# EAGLE schematic 128rfr2 (EAGLE 6.4)
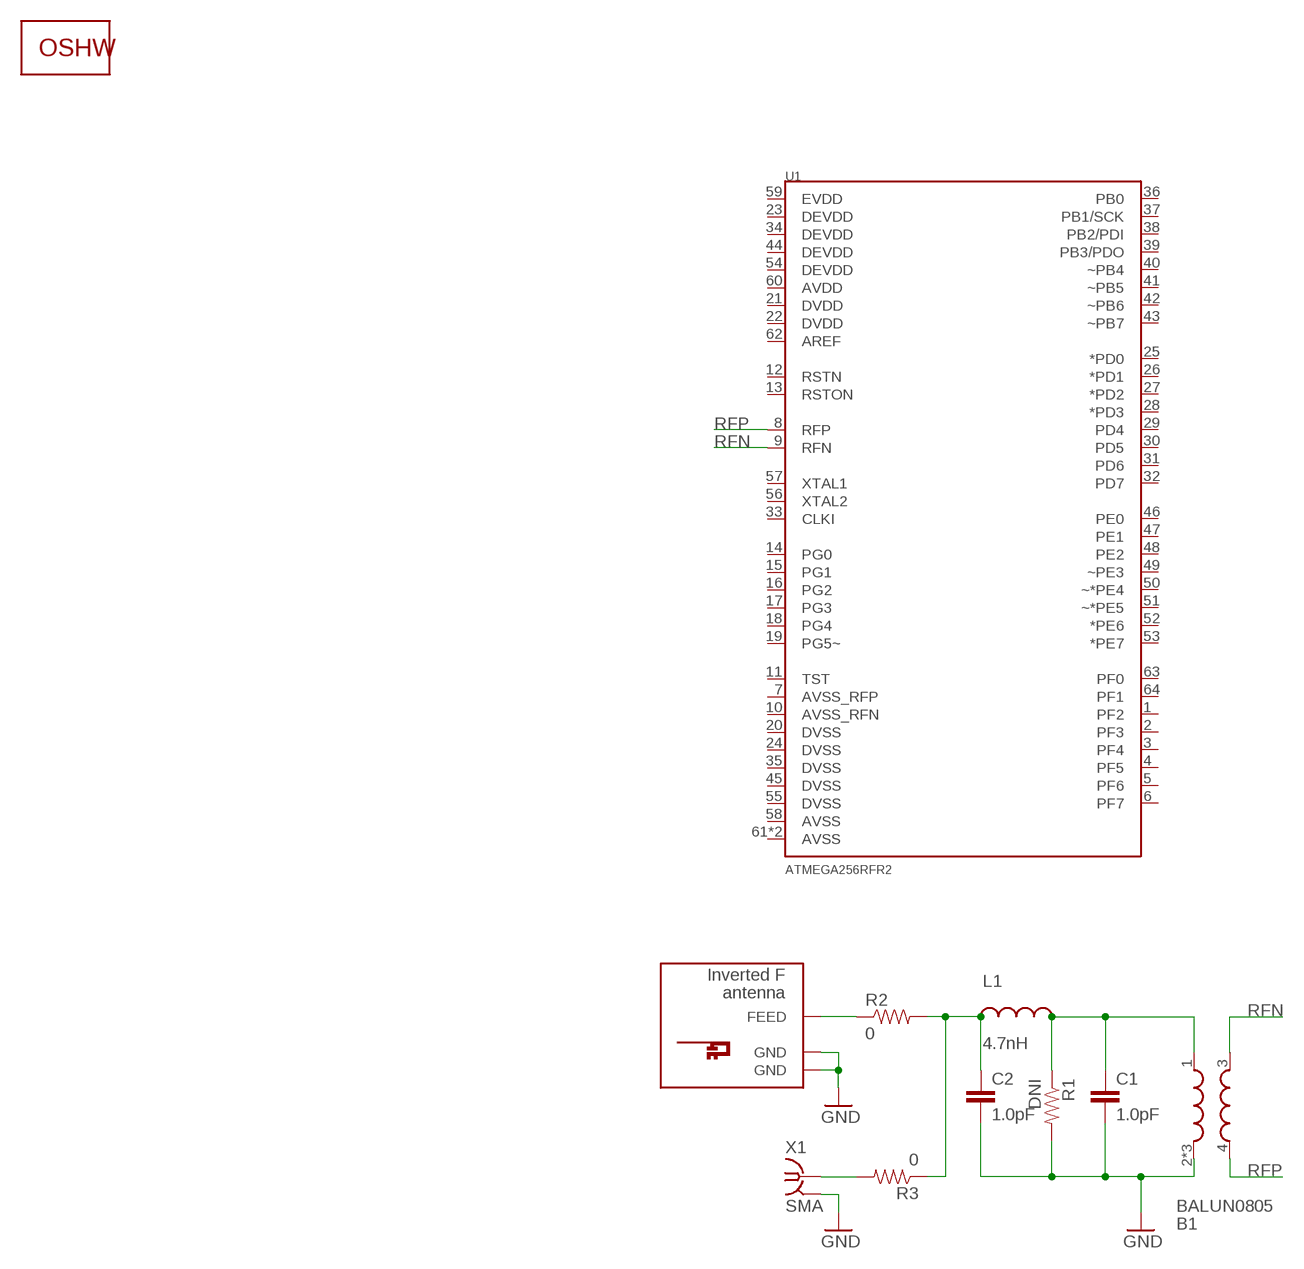
[diagram p0: schematic, sheet 1]

## Parts
B1  BALUN0805  [BALUN-2-4GHZ]
C1  1.0pF  CAP0402-CAP  [0402-CAP]
C2  1.0pF  CAP0402-CAP  [0402-CAP]
L1  4.7nH  INDUCTOR  [0402-CAP]
R1  DNI  RESISTOR0402-RES  [0402-RES]
R2  0  RESISTOR0402-RES  [0402-RES]
R3  0  RESISTOR0402-RES  [0402-RES]
U1  ATMEGA256RFR2  [QFN-64]
U$1  INVERTED_F_ANTENNA+5  [DN007+5]
U$2  LOGO-OSHWCOPPER  [LOGO-OSHW-COPPER]
X1  SMA  SMA-142-0701-801/806  [J502-ND-142-0701-801/806]

## Nets
GND: B1.2(GND) B1.5(GND) B1.6(GND) C1.2 C2.2 R1.2 U$1.GND U$1.GND@1(GND) X1.G@1 X1.G@2 X1.G@3 X1.G@4
N$1: R2.1 U$1.FEED
N$2: B1.1(IN) C1.1 L1.2 R1.1
N$3: C2.1 L1.1 R2.2 R3.1
N$4: R3.2 X1.1
RFN: B1.3(OUT1) U1.9(RFN)
RFP: B1.4(OUT2) U1.8(RFP)
Unconnected: U1.1(PF2) U1.2(PF3) U1.3(PF4) U1.4(PF5) U1.5(PF6) U1.6(PF7) U1.7(AVSS_RFP) U1.10(AVSS_RFN) U1.11(TST) U1.12(RSTN) U1.13(RSTON) U1.14(PG0) U1.15(PG1) U1.16(PG2) U1.17(PG3) U1.18(PG4) U1.19(PG5~) U1.20(DVSS) U1.21(DVDD) U1.22(DVDD) U1.23(DEVDD) U1.24(DVSS) U1.25(*PD0) U1.26(*PD1) U1.27(*PD2) U1.28(*PD3) U1.29(PD4) U1.30(PD5) U1.31(PD6) U1.32(PD7) U1.33(CLKI) U1.34(DEVDD) U1.35(DVSS) U1.36(PB0) U1.37(PB1/SCK) U1.38(PB2/PDI) U1.39(PB3/PDO) U1.40(~PB4) U1.41(~PB5) U1.42(~PB6) U1.43(~PB7) U1.44(DEVDD) U1.45(DVSS) U1.46(PE0) U1.47(PE1) U1.48(PE2) U1.49(~PE3) U1.50(~*PE4) U1.51(~*PE5) U1.52(*PE6) U1.53(*PE7) U1.54(DEVDD) U1.55(DVSS) U1.56(XTAL2) U1.57(XTAL1) U1.58(AVSS) U1.59(EVDD) U1.60(AVDD) U1.61(AVSS) U1.62(AREF) U1.63(PF0) U1.64(PF1) U1.PADDLE(AVSS)

## Library data of the parts
B1 = Pinoccio:BALUN: Johanson 2450BM15A001
C1 C2 = Pinoccio:CAP: Capacitor Standard 0603 ceramic capacitor, and 0.1" leaded capacitor.
L1 = Pinoccio:INDUCTOR
R1-R3 = Pinoccio:RESISTOR: Resistor Basic schematic elements and footprints for 0603, 1206, and PTH resistors.
U1 = Pinoccio:ATMEGA256RFR2
U$1 = antenna:INVERTED_F_ANTENNA: 2.4GHz Inverted F Antenna Based on TI Design Note DN007
U$2 = Pinoccio:LOGO-OSHW
X1 = con-coax:SMA-: SMA 50 Ohm End Launch Jack Receptacle - Round Contact Johnson Components Source: www.johnsoncomponents.com .. J502-ND.pdf; MF: JOHNSON COMPONENTS; MPN: 142-0701-801; OC_FARNELL: 1608592; OC_NEWARK: 90F2624